# Altium project sensor_power.PrjPCB
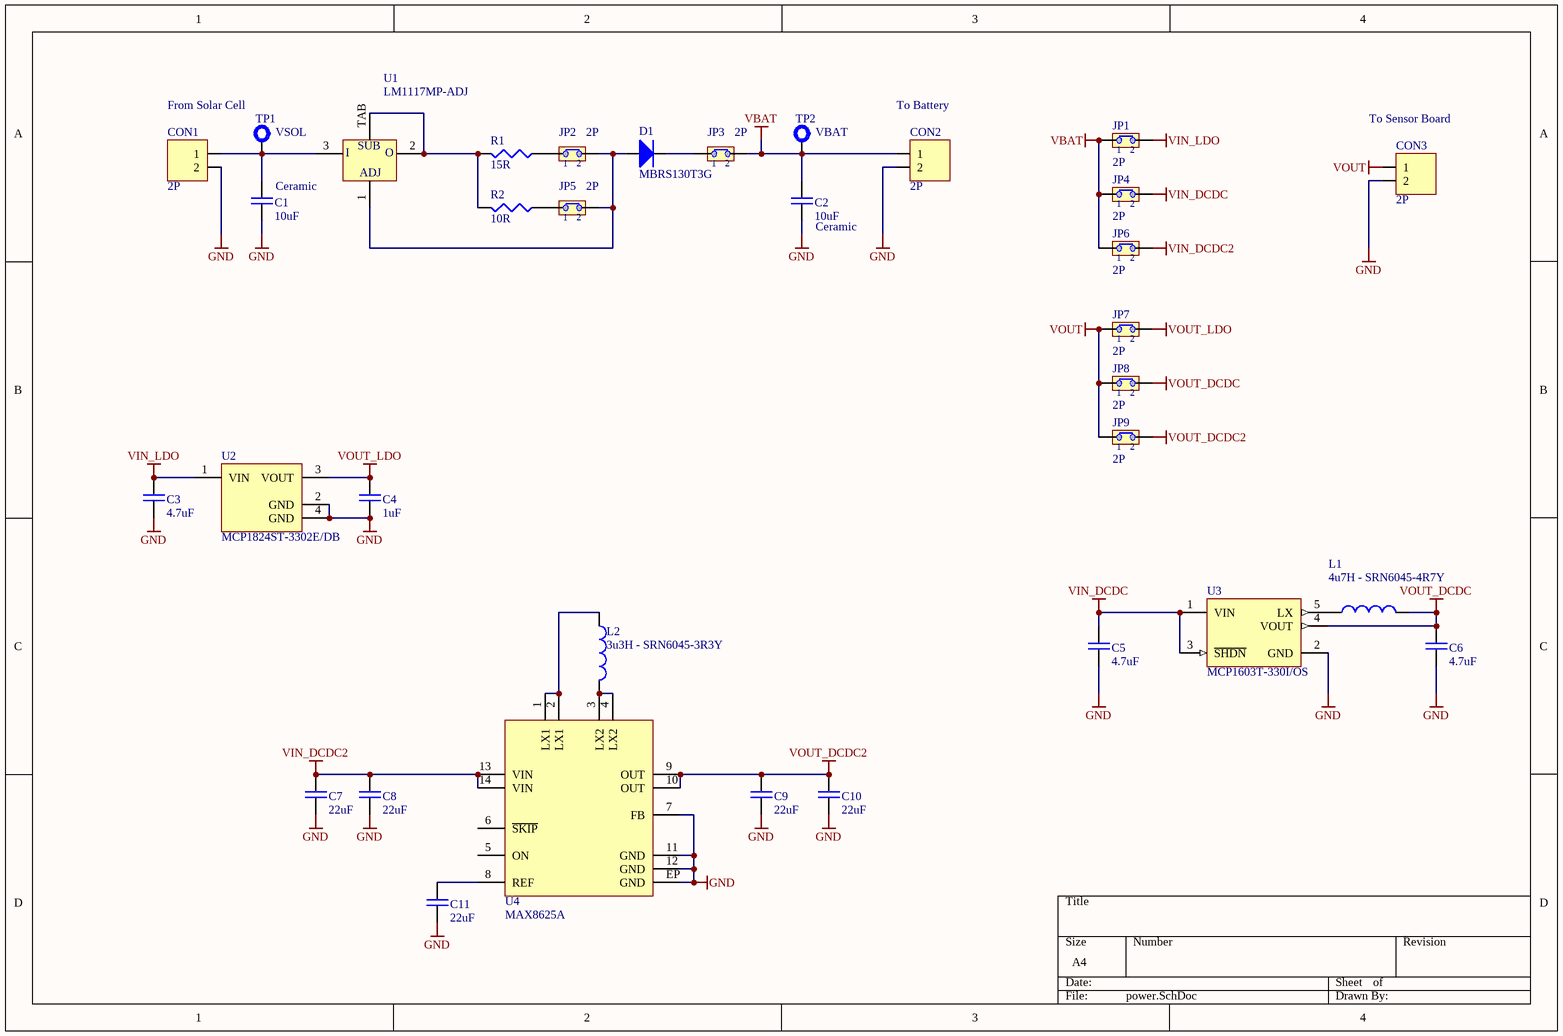
[diagram p0: power.SchDoc]
1 sheet, 34 parts. Net scope: global (net labels, ports and power ports of the same name join across sheets).
Board file: power.PcbDoc

## Sheet power.SchDoc
size A4

### Parts
C1  10uF  [0805]
C2  10uF  [0805]
C3  4.7uF  [0805]
C4  1uF  [0805]
C5  4.7uF  [0805]
C6  4.7uF  [0805]
C7  22uF  [0805]
C8  22uF  [0805]
C9  22uF  [0805]
C10  22uF  [0805]
C11  22uF  [0805]
CON1  2P  [JST-2MM]
CON2  2P  [INTERLOCK2-5MM]
CON3  2P  [INTERLOCK2-5MM]
D1  MBRS130T3G  [DO-214AC]
JP1  2P  [SIP-2]
JP2  2P  [SIP-2]
JP3  2P  [SIP-2]
JP4  2P  [SIP-2]
JP5  2P  [SIP-2]
JP6  2P  [SIP-2]
JP7  2P  [SIP-2]
JP8  2P  [SIP-2]
JP9  2P  [SIP-2]
L1  4u7H - SRN6045-4R7Y  [6X6]
L2  3u3H - SRN6045-3R3Y  [6X6]
R1  15R  [0805]
R2  10R  [0805]
TP1  VSOL  [TERMINAL]  (no BOM)
TP2  VBAT  [TERMINAL]  (no BOM)
U1  LM1117MP-ADJ  [SOT-223]
U2  MCP1824ST-3302E/DB  [SOT-223-DB3_M]
U3  MCP1603T-330I/OS  [TSOT-OS5_M]
U4  MAX8625A  [TDFN-EP-14]

### Nets
GND: C1.1 C2.1 C3.1 C4.1 C5.1 C6.1 C7.2 C8.2 C9.1 C10.1 C11.2 CON1.2 CON2.2 CON3.2 U2.2(GND) U2.4(GND) U3.2(GND) U4.7(FB) U4.11(GND) U4.12(GND) U4.EP(GND)
VBAT: C2.2 CON2.1 JP1.1 JP3.2 JP4.1 JP6.1 TP2.1(TP)
VIN_DCDC: C5.2 JP4.2 U3.1(VIN) U3.3(~{SHDN})
VIN_DCDC2: C7.1 C8.1 JP6.2 U4.13(VIN) U4.14(VIN)
VIN_LDO: C3.2 JP1.2 U2.1(VIN)
VOUT: CON3.1 JP7.1 JP8.1 JP9.1
VOUT_DCDC: C6.2 JP8.2 L1.2 U3.4(VOUT)
VOUT_DCDC2: C9.2 C10.2 JP9.2 U4.9(OUT) U4.10(OUT)
VOUT_LDO: C4.2 JP7.2 U2.3(VOUT)
NetC1_2: C1.2 CON1.1 TP1.1(TP) U1.3(IN)
NetC11_1: C11.1 U4.8(REF)
NetD1_A: D1.A JP2.2 JP5.2 U1.1(ADJ)
NetD1_K: D1.K JP3.1
NetJP2_1: JP2.1 R1.1
NetJP5_1: JP5.1 R2.1
NetL1_1: L1.1 U3.5(LX)
NetL2_1: L2.1 U4.1(LX1) U4.2(LX1)
NetL2_2: L2.2 U4.3(LX2) U4.4(LX2)
NetR1_2: R1.2 R2.2 U1.2(OUT) U1.TAB(SUB)

Not connected (* = marked no-connect by the designer): U4 5(ON) 6(~{SKIP})

### Notes on the sheet
- From Solar Cell
- (near CON2) To Battery
- (near CON3) To Sensor Board
- (near C1) Ceramic
- (near C2) Ceramic
- (in symbol LM1117-ADJ) I; O

### Library data of the parts
C1-C11 = CAP: Capacitor; Owner: Nuno Brum; Sub-Type: Ceramic; Assembly: INS; Maximum Voltage: *; Creation Date: 2005-04-28; Status: Valid; Validation date: 2006-05-15; Type: Capacitor
CON1-CON3 = CON02: Connector 2 pins; Owner: Rui Rebelo; Assembly: INS; Sub-Type: Connector; Creation Date: 2005-05-27; Status: Valid; Validation Date: 2006-05-15; Type: Electrical & Mechanical
D1 = Diode: Vishay Standard Avalanche Sinterglass Diode; Owner: Nuno Brum; Sub-Type: Generic; Assembly: INS; Validation date: 2006-05-15; Creation Date: 2001-06-05; Status: Valid; Model: MBRS130T3G; Type: Diode
JP1-JP9 = JMP2: 2-pin Jumper; Owner: Nuno Brum; Sub-Type: Connector; STATE1: 1; Assembly: INS; Validation Date: 2006-05-15; Creation Date: 2002-07-17; Status: Valid; Type: Electrical & Mechanical
L1 L2 = IND: Inductor; Owner: Nuno Brum; Sub-Type: Generic; Assembly: INS; Validation date: 2006-05-15; Creation Date: 2002-07-17; Status: Valid; Type: Inductor
R1 R2 = RES: Resistor; Owner: Nuno Brum; Sub-Type: Generic; Assembly: INS; Validation date: 2006-05-15; Creation Date: 2002-07-17; Status: Valid; Power: *; Type: Resistor
TP1 TP2 = TEST-PROBE: Test/Probe Point; Owner: Nuno Brum; Sub-Type: Mechanical; Assembly: PCB; Validation Date: 2006-05-15; Type: PCB; Creation Date: 2005-06-01; Status: Valid
U1 = LM1117-ADJ: 800mA, Low Drop Adjustable Voltage Regulator; Sub-Type: Power; Owner: Nuno Brum; Assembly: INS; Status: Valid; Type: Integrated Circuits; Creation Date: 2005-06-01; Validation date: 2006-05-15
U2 = MCP1824ST-3302E/DB: 300 mA, Low Voltage, Low Quiescent Current LDO Regulator, 3-Pin SOT-223, Extended Temperature, Tape and Reel; Published: 29-Jan-2009; DatasheetVersion: revA, Aug-2007; PackageVersion: revBB, Aug-2009; PackageReference: SOT-223-DB3; Publisher: Altium Limited; PackageDescription: 3-Lead Plastic Small Outline Transistor (DB) [SOT-223]; Supplier 1: Digi-Key; Supplier Part Number 1: MCP1824ST-3302E/DBTR-ND; Supplier 2: Digi-Key; Supplier Part Number 2: MCP1824ST-3302E/DBCT-ND; Supplier 3: Digi-Key; Supplier Part Number 3: MCP1824ST-3302E/DBDKR-ND; Supplier 4: Farnell; Supplier Part Number 4: 1578379; ComponentLink1Description: Datasheet; ComponentLink1URL: http://ww1.microchip.com/downloads/en/DeviceDoc/22070a.pdf; ComponentLink2Description: Packaging Specification; ComponentLink2URL: http://www.microchip.com/stellent/groups/techpub_sg/documents/packagingspec/en012702.pdf; ComponentLink3Description: Microchip.com Home; ComponentLink3URL: http://www.microchip.com/
U3 = MCP1603T-330I/OS: 500mA Synchronous Buck Regulator, 3.3V, 2.0 MHz, 5-Pin TSOT, Industrial Temperature, Tape and Reel; Published: 29-Jan-2009; DatasheetVersion: revA, May-2007; PackageVersion: revBB, Aug-2009; PackageReference: TSOT-OS5; Publisher: Altium Limited; PackageDescription: 5-Lead Plastic Small Outline Transistor (OS) [TSOT]; Supplier 1: Digi-Key; Supplier Part Number 1: MCP1603T-330I/OSTR-ND; Supplier 2: Digi-Key; Supplier Part Number 2: MCP1603T-330I/OSCT-ND; Supplier 3: Digi-Key; Supplier Part Number 3: MCP1603T-330I/OSDKR-ND; Supplier 4: Farnell; Supplier Part Number 4: 1439373; ComponentLink1Description: Datasheet; ComponentLink1URL: http://ww1.microchip.com/downloads/en/DeviceDoc/22042a.pdf; ComponentLink2Description: Packaging Specification; ComponentLink2URL: http://www.microchip.com/stellent/groups/techpub_sg/documents/packagingspec/en012702.pdf
U4 = MAX8625A: Step up/down DCDC converter